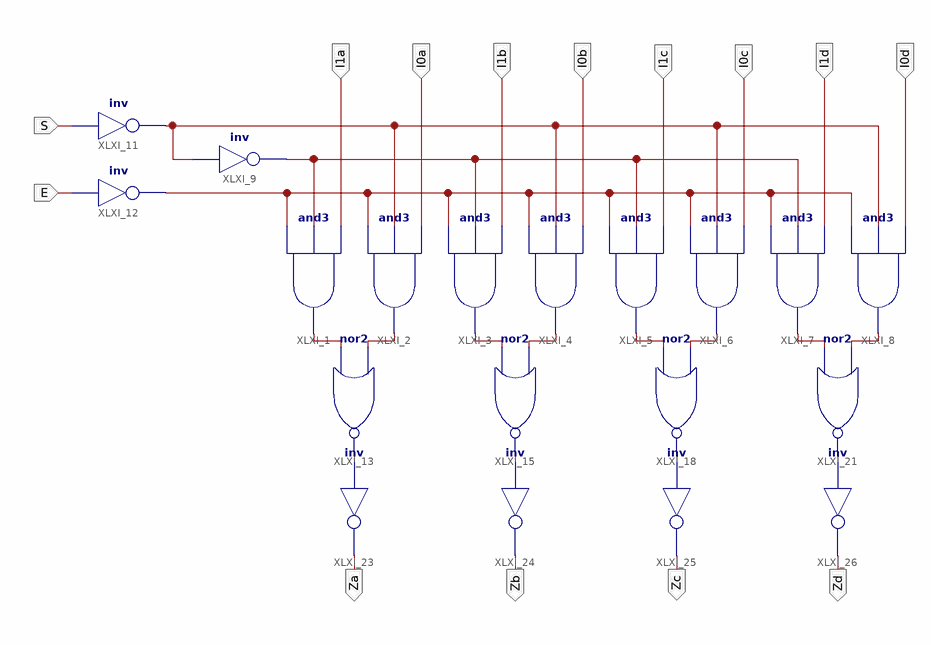
[diagram p0: schematic sheet 1]
// Xilinx ISE schematic Quad_2input_MUX.sch (spartan6) as structural Verilog: 19 symbols, 14 ports
module Quad_2input_MUX (
  input  I0a,
  input  I0b,
  input  I1c,
  input  I0c,
  input  I1d,
  input  I0d,
  input  I1b,
  input  S,
  input  E,
  input  I1a,
  output Za,
  output Zb,
  output Zc,
  output Zd
);

  wire XLXN_1, XLXN_2, XLXN_13, XLXN_16, XLXN_18, XLXN_20, XLXN_22, XLXN_23, XLXN_25, XLXN_28, XLXN_29,
       XLXN_32, XLXN_33, XLXN_34, XLXN_35;

  and XLXI_1 (XLXN_16, XLXN_1, XLXN_2, I1a);
  and XLXI_2 (XLXN_29, XLXN_1, XLXN_13, I0a);
  and XLXI_3 (XLXN_18, XLXN_1, XLXN_2, I1b);
  and XLXI_5 (XLXN_20, XLXN_1, XLXN_2, I1c);
  and XLXI_6 (XLXN_22, XLXN_1, XLXN_13, I0c);
  and XLXI_7 (XLXN_23, XLXN_1, XLXN_2, I1d);
  and XLXI_8 (XLXN_25, XLXN_1, XLXN_13, I0d);
  and XLXI_4 (XLXN_28, XLXN_1, XLXN_13, I0b);
  not XLXI_9 (XLXN_2, XLXN_13);
  not XLXI_11 (XLXN_13, S);
  nor XLXI_13 (XLXN_32, XLXN_16, XLXN_29);
  nor XLXI_15 (XLXN_33, XLXN_18, XLXN_28);
  nor XLXI_18 (XLXN_34, XLXN_20, XLXN_22);
  nor XLXI_21 (XLXN_35, XLXN_23, XLXN_25);
  not XLXI_12 (XLXN_1, E);
  not XLXI_23 (Za, XLXN_32);
  not XLXI_24 (Zb, XLXN_33);
  not XLXI_25 (Zc, XLXN_34);
  not XLXI_26 (Zd, XLXN_35);
endmodule
